# Altium schematic sheet SmartSocket.SchDoc
size A3; SheetNumber: 2; SheetTotal: 2
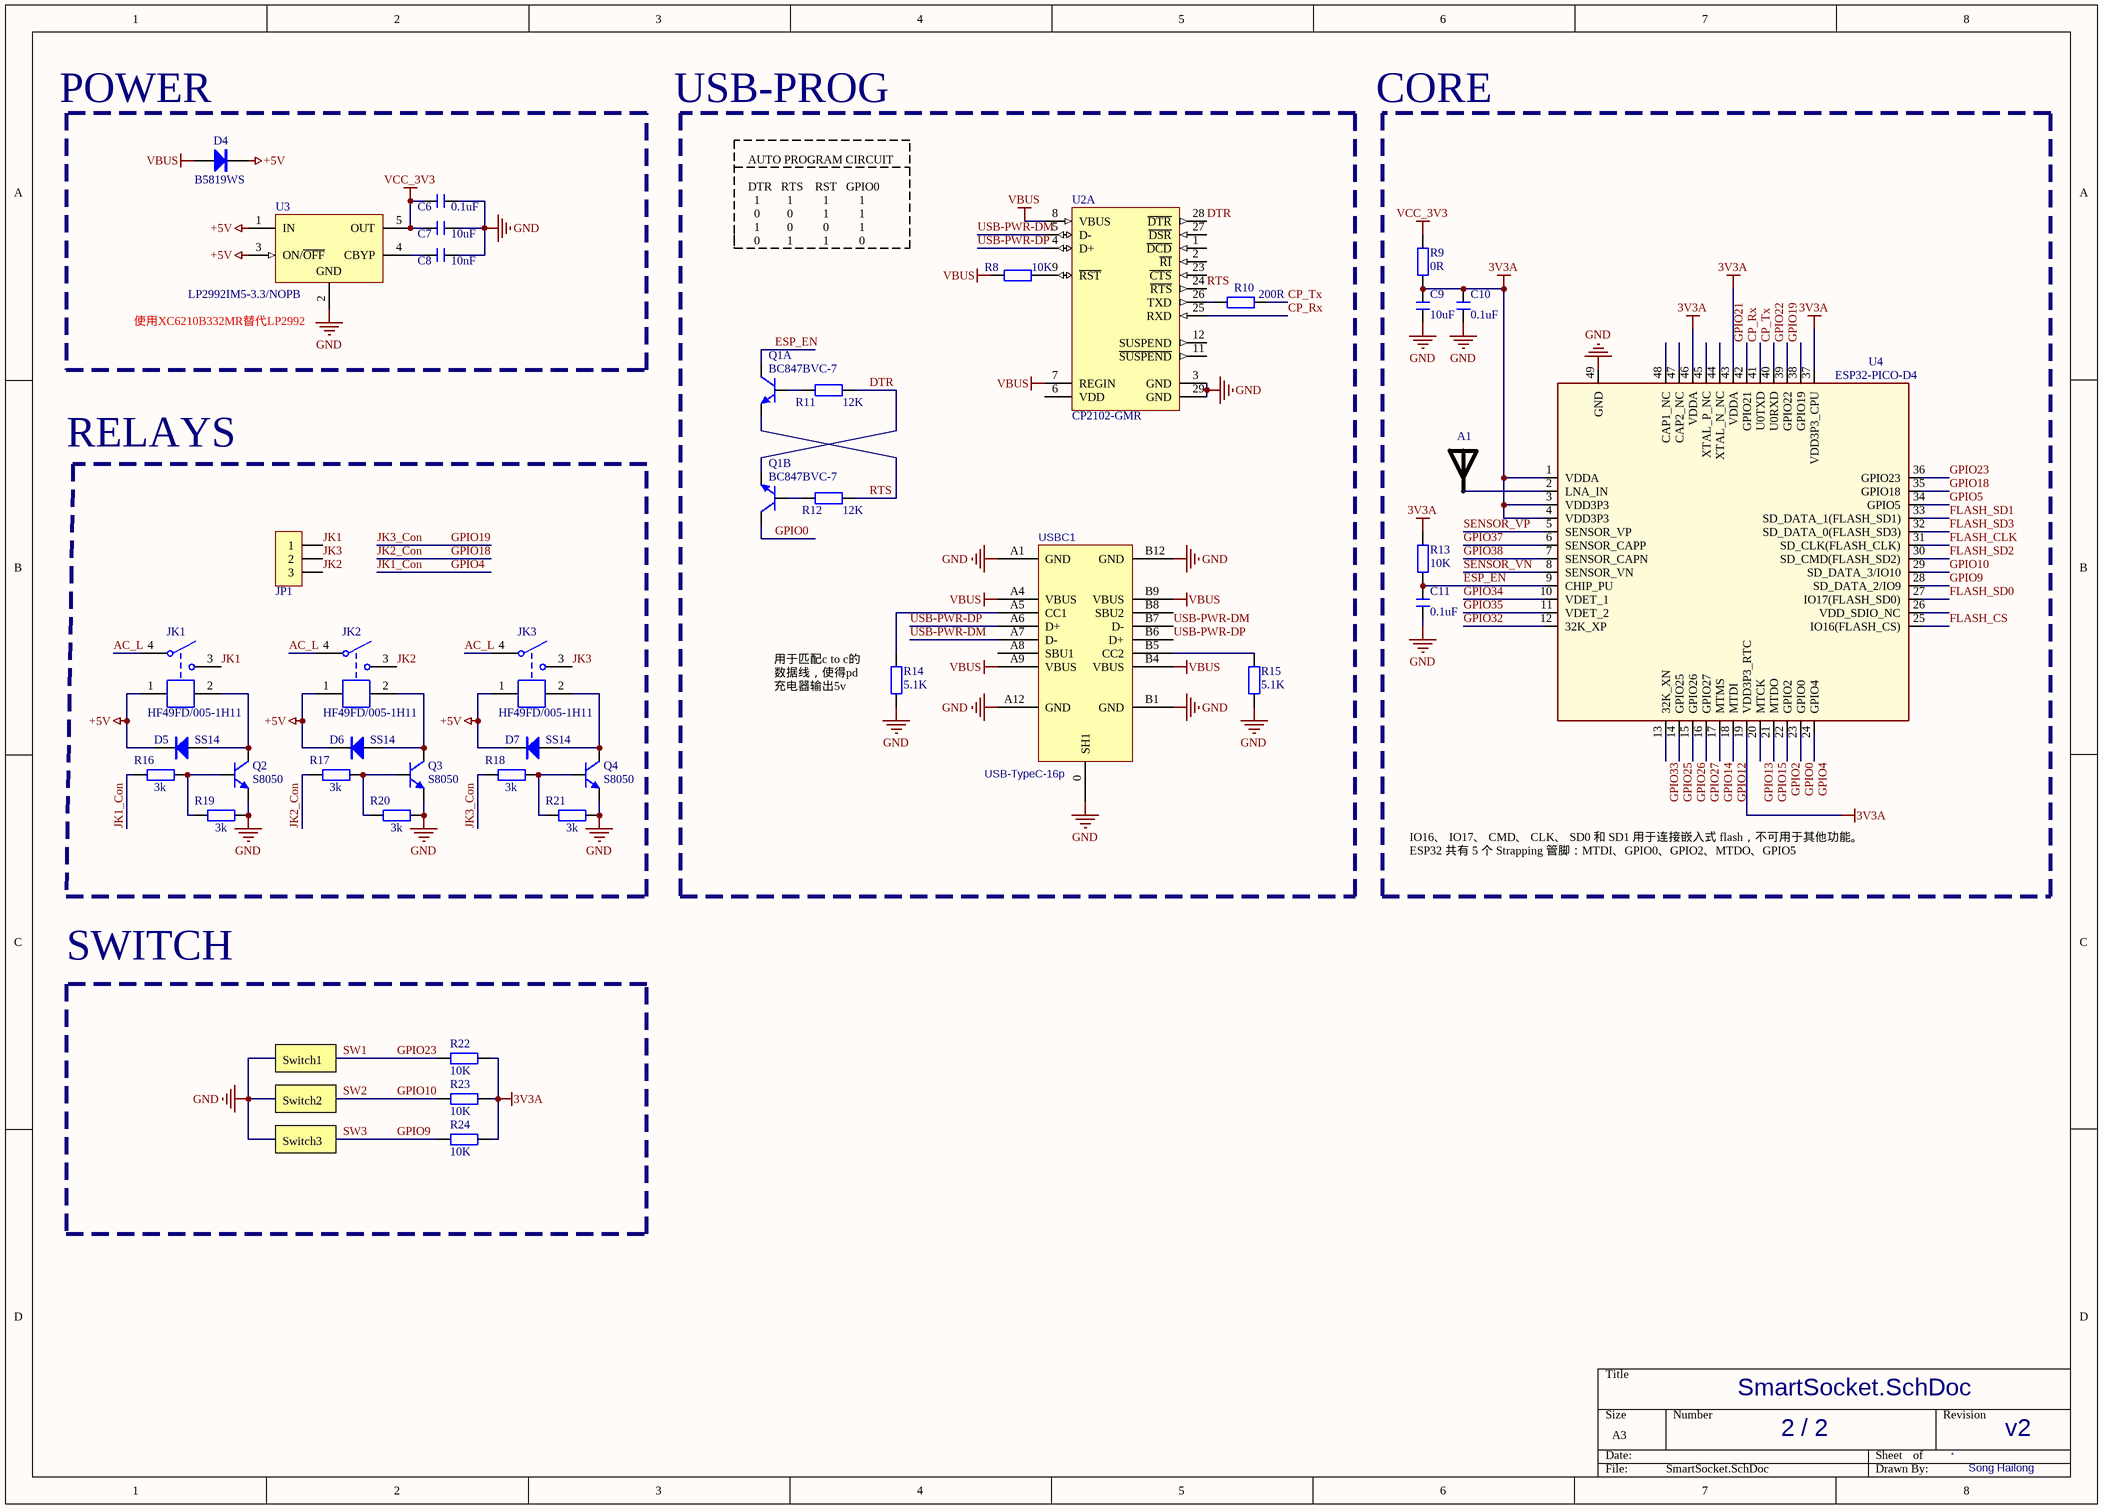
[diagram p0: SmartSocket.SchDoc]

## Parts
A1  AN2051-245  [AN2051-245]  (value not drawn)
C6  0.1uF  [C 0402_L]
C7  10uF  [C 0402_L]
C8  10nF  [C 0402_L]
C9  10uF  [C 0402_L]
C10  0.1uF  [C 0402_L]
C11  0.1uF  [C 0402_L]
D4  B5819WS  [SOD-323]
D5  SS14  [SMA]
D6  SS14  [SMA]
D7  SS14  [SMA]
JK1  HF49FD/005-1H11  [HF49-XX-1H11]
JK2  HF49FD/005-1H11  [HF49-XX-1H11]
JK3  HF49FD/005-1H11  [HF49-XX-1H11]
JP1  HDR-1X3  [KF301-5.0-3P]  (value not drawn)
Q1  BC847BVC-7  [SOT563-6]  (parts A,B of 2)
Q2  S8050  [SOT23-3N]
Q3  S8050  [SOT23-3N]
Q4  S8050  [SOT23-3N]
R8  10K  [R 0402_L]
R9  0R  [R 0402_L]
R10  200R  [R 0402_L]
R11  12K  [R 0402_L]
R12  12K  [R 0402_L]
R13  10K  [R 0402_L]
R14  5.1K  [R 0402_L]
R15  5.1K  [R 0402_L]
R16  3k  [R 0603_L]
R17  3k  [R 0603_L]
R18  3k  [R 0603_L]
R19  3k  [R 0603_L]
R20  3k  [R 0603_L]
R21  3k  [R 0603_L]
R22  10K  [R 0402_L]
R23  10K  [R 0402_L]
R24  10K  [R 0402_L]
U2  CP2102-GMR  [SLAB-QFN-28-3125x3125TP_M]  (part A of 2)
U3  LP2992IM5-3.3/NOPB  [DBV0005A_N]
U4  ESP32-PICO-D4  [QFN48]
USBC1  USB-TypeC-16p  [TYPE-C-USB-16P-1]

## Blocks framed on the sheet
使用XC6210B332MR替代LP2992: C6-C8 D4 U3
RELAYS: D5-D7 JK1-JK3 JP1 Q2-Q4 R16-R21
SWITCH: R22-R24

## Nets
3V3A: C9.2 C10.2 R9.1 R13.2 R22.2 R23.2 R24.2 U4.1(VDDA) U4.3(VDD3P3) U4.4(VDD3P3) U4.19(VDD3P3_RTC) U4.37(VDD3P3_CPU) U4.43(VDDA) U4.46(VDDA)
+5V: D4.2(K) D5.2(K) D6.2(K) D7.2(K) JK1.1 JK2.1 JK3.1 U3.1(IN) U3.3(ON/~{OFF})
GND: C6.2 C7.2 C8.2 C9.1 C10.1 C11.1 Q2.2(E) Q3.2(E) Q4.2(E) R14.1 R15.1 R19.1 R20.1 R21.1 U2.3(GND) U2.29(GND) U3.2(GND) U4.49(GND) USBC1.0(SH1) USBC1.A1(GND) USBC1.A12(GND) USBC1.B1(GND) USBC1.B12(GND)
VBUS: D4.1(A) R8.1 U2.7(REGIN) U2.8(VBUS) USBC1.A4(VBUS) USBC1.A9(VBUS) USBC1.B4(VBUS) USBC1.B9(VBUS)
VCC_3V3: C6.1 C7.1 R9.2 U3.5(OUT)
AC_L: JK1.4 JK2.4 JK3.4
CP_Rx: U2.25(RXD) U4.41(U0TXD)
CP_Tx: R10.2 U4.40(U0RXD)
DTR: Q1.4(E2) R11.2 U2.28(~{DTR})
ESP_EN: C11.2 Q1.6(C1) R13.1 U4.9(CHIP_PU)
FLASH_CLK: U4.31(SD_CLK(FLASH_CLK))
FLASH_CS: U4.25(IO16(FLASH_CS))
FLASH_SD0: U4.27(IO17(FLASH_SD0))
FLASH_SD1: U4.33(SD_DATA_1(FLASH_SD1))
FLASH_SD2: U4.30(SD_CMD(FLASH_SD2))
FLASH_SD3: U4.32(SD_DATA_0(FLASH_SD3))
GPIO0: Q1.3(C2) U4.23(GPIO0)
GPIO2: U4.22(GPIO2)
GPIO4: R16.2 U4.24(GPIO4)  [also labelled JK1_Con]
GPIO5: U4.34(GPIO5)
GPIO9: R24.1 U4.28(SD_DATA_2/IO9)  [also labelled SW3]
GPIO10: R23.1 U4.29(SD_DATA_3/IO10)  [also labelled SW2]
GPIO12: U4.18(MTDI)
GPIO13: U4.20(MTCK)
GPIO14: U4.17(MTMS)
GPIO15: U4.21(MTDO)
GPIO18: R17.2 U4.35(GPIO18)  [also labelled JK2_Con]
GPIO19: R18.2 U4.38(GPIO19)  [also labelled JK3_Con]
GPIO21: U4.42(GPIO21)
GPIO22: U4.39(GPIO22)
GPIO23: R22.1 U4.36(GPIO23)  [also labelled SW1]
GPIO25: U4.14(GPIO25)
GPIO26: U4.15(GPIO26)
GPIO27: U4.16(GPIO27)
GPIO32: U4.12(32K_XP)
GPIO33: U4.13(32K_XN)
GPIO34: U4.10(VDET_1)
GPIO35: U4.11(VDET_2)
GPIO37: U4.6(SENSOR_CAPP)
GPIO38: U4.7(SENSOR_CAPN)
JK1: JK1.3 JP1.1
JK2: JK2.3 JP1.3
JK3: JK3.3 JP1.2
RTS: Q1.1(E1) R12.2 U2.24(~{RTS})
SENSOR_VN: U4.8(SENSOR_VN)
SENSOR_VP: U4.5(SENSOR_VP)
USB-PWR-DM: U2.5(D-) USBC1.A7(D-) USBC1.B7(D-)
USB-PWR-DP: U2.4(D+) USBC1.A6(D+) USBC1.B6(D+)
NetA1_1: A1.1 U4.2(LNA_IN)
NetC8_1: C8.1 U3.4(CBYP)
NetD5_1: D5.1(A) JK1.2 Q2.3(C)
NetD6_1: D6.1(A) JK2.2 Q3.3(C)
NetD7_1: D7.1(A) JK3.2 Q4.3(C)
NetQ1_2: Q1.2(B1) R11.1
NetQ1_5: Q1.5(B2) R12.1
NetQ2_1: Q2.1(B) R16.1 R19.2
NetQ3_1: Q3.1(B) R17.1 R20.2
NetQ4_1: Q4.1(B) R18.1 R21.2
NetR8_2: R8.2 U2.9(~{RST})
NetR10_1: R10.1 U2.26(TXD)
NetR14_2: R14.2 USBC1.A5(CC1)
NetR15_2: R15.2 USBC1.B5(CC2)

Not connected (* = marked no-connect by the designer): U2 1(~{DCD}) 2(~{RI}) 6(VDD) 11(~{SUSPEND}) 12(SUSPEND) 23(~{CTS}) 27(~{DSR}); U4 26(VDD_SDIO_NC) 44(XTAL_N_NC) 45(XTAL_P_NC) 47(CAP2_NC) 48(CAP1_NC); USBC1 A8(SBU1) B8(SBU2)

## Notes on the sheet
- POWER
- USB-PROG
- CORE
- AUTO PROGRAM CIRCUIT
  DTR   RTS    RST   GPIO0
  1         1          1          1
  0         0          1          1
  1         0          0          1
  0         1          1          0
- (near R14) 用于匹配c to c的数据线，使得pd充电器输出5v
- IO16、 IO17、 CMD、 CLK、 SD0 和 SD1 用于连接嵌入式 flash，不可用于其他功能。
  ESP32 共有 5 个 Strapping 管脚：MTDI、GPIO0、GPIO2、MTDO、GPIO5
- Switch1
- Switch2
- Switch3
- /
- v2
- Song Hailong

## Library data of the parts
A1 = ANT-Rainsun-AP2051: 天线AN2051-245
C6-C11 = C: 无极性贴片电容; 版权归属: 源创客; BOM名称: 无极性贴片电容; 学习资源: www.ooocke.com
D4 = 1N5819: 肖特基二极管; 版权归属: 源创客; 属性: 40V/2A; BOM名称: 肖特基二极管; 学习资源: www.ooocke.com
D5-D7 = SS14: 肖特基二极管; 版权归属: 源创客; 属性: 40V/1A; BOM名称: 肖特基二极管; 学习资源: www.ooocke.com
JK1-JK3 = HF49FD/005-1H11: 5V一组常开
JP1 = Header 03 5.0: 3P接插件; 版权归属: 源创客; BOM名称: 3P接插件; 学习资源: www.ooocke.com
Q2-Q4 = 8050-SMD: 高频放大-NPN型; 版权归属: 源创客; 属性: 40V 1.5A 1W 100MHZ; BOM名称: 高频放大-NPN型; 学习资源: www.ooocke.com
R8-R24 = R: 贴片电阻; 版权归属: 源创客; BOM名称: 贴片电阻; 学习资源: www.ooocke.com
U2 = CMP-2000-04924-1: Single-Chip USB to URAT Bridge, 3.3 V, -40 to 85 degC, 28-Pin QFN, RoHS, Tape and Reel; Manufacturer: Silicon Labs; Interface Circuit Standard 1: RS-232; Transmitter and Receiver FIFO Counter: No; Supply Current: 26mA; Operating Supply Voltage (Min): 3V; Operating Supply Voltage (Typ): 3.3V; Data Rate: 1000kbps; Operating Supply Voltage (Max): 3.6V; Number of Channels: 1; Package URL: http://www.silabs.com/Support%20Documents/TechnicalDocs/C8051T61x.pdf; Operating Temperature (Max): 85C; Datasheet URL: http://www.mouser.com/ds/2/368/CP2102-9-247052.pdf; Operating Temperature Classification: Industrial; Operating Temperature (Min): -40C; Package Description: 28-Pin Quad-Flat No-Leads Package, Body 5 x 5 mm, Pitch 0.5 mm; Manufacturer URL: http://www.silabs.com/; Rad Hardened: No; Package Reference: QFN-28; Pin Count: 28; Packaging: TapeandReel; Mounting: SurfaceMount; Package Type: QFNEP; Datasheet Version: Rev. 1.6, 12/2013
U3 = CMP-0062-02175-3: Micropower 250 mA Low-Noise Ultra Low-Dropout Regulator, 5-pin SOT-23, Pb-Free; Manufacturer: Texas Instruments; CompType: LDO IC; PackageTopMarking: LFEB*XTT; PowerWise: N; PackageReference: DBV0005A; ComponentLink1Description: Datasheet URL; RoHS: Y; PackageDescription: Molded SOT-23, .115 x .063 x .040 in Body, 5 Lead, .0375 in Pitch; ComponentLink1URL: http://www.ti.com/general/docs/lit/getliterature.tsp?genericPartNumber=LP2992&fileType=pdf; PinCount: 5